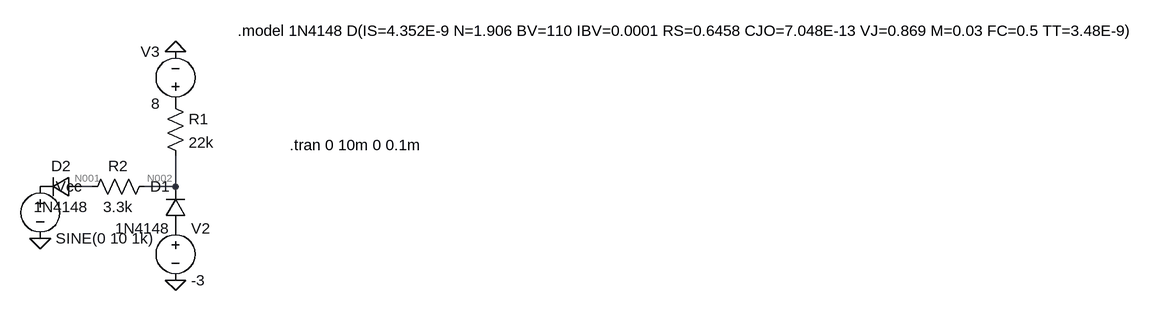
[diagram p0: schematic Draft1.asc]
Draft1.asc, the LTspice schematic file:
Version 4
SHEET 1 1808 680
WIRE 80 176 64 176
WIRE 208 176 208 128
WIRE 208 176 160 176
FLAG 0 256 0
FLAG 208 320 0
FLAG 208 -32 0
SYMBOL diode 224 240 R180
WINDOW 0 24 64 Left 2
WINDOW 3 24 0 Left 2
SYMATTR InstName D1
SYMATTR Value 1N4148
SYMBOL diode 64 160 R90
WINDOW 0 0 32 VBottom 2
WINDOW 3 32 32 VTop 2
SYMATTR InstName D2
SYMATTR Value 1N4148
SYMBOL res 192 32 R0
SYMATTR InstName R1
SYMATTR Value 22k
SYMBOL res 64 192 R270
WINDOW 0 32 56 VTop 2
WINDOW 3 0 56 VBottom 2
SYMATTR InstName R2
SYMATTR Value 3.3k
SYMBOL voltage 0 160 R0
WINDOW 123 0 0 Left 0
WINDOW 39 0 0 Left 0
SYMATTR InstName Vcc
SYMATTR Value SINE(0 10 1k)
SYMBOL voltage 208 224 R0
WINDOW 123 0 0 Left 0
WINDOW 39 0 0 Left 0
SYMATTR InstName V2
SYMATTR Value -3
SYMBOL voltage 208 64 R180
WINDOW 0 24 96 Left 2
WINDOW 3 24 16 Left 2
WINDOW 123 0 0 Left 0
WINDOW 39 0 0 Left 0
SYMATTR InstName V3
SYMATTR Value 8
TEXT 384 112 Left 2 !.tran 0 10m 0 0.1m
TEXT 304 -64 Left 2 !.model 1N4148 D(IS=4.352E-9 N=1.906 BV=110 IBV=0.0001 RS=0.6458 CJO=7.048E-13 VJ=0.869 M=0.03 FC=0.5 TT=3.48E-9)

The netlist it stands for:
* Draft1.asc
D1 P001 N002 1N4148
D2 N001 P002 1N4148
R1 P003 N002 22k
R2 N001 N002 3.3k
Vcc P002 0 SINE(0 10 1k)
V2 P001 0 -3
V3 P003 0 8
.model D D
.lib standard.dio
.tran 0 10m 0 0.1m
.model 1N4148 D(IS=4.352E-9 N=1.906 BV=110 IBV=0.0001 RS=0.6458 CJO=7.048E-13 VJ=0.869 M=0.03 FC=0.5 TT=3.48E-9)
.backanno
.end

* Results of the author's LTspice run, read from the files saved beside the schematic
* Operating Point, zero values left out:
*   V(p001) = -3 V
*   V(n002) = 1.52 V
*   V(n001) = 548.5 mV
*   V(p003) = 8 V
*   I(D2) = 294.5 µA
*   I(D1) = -4.357 nA
*   I(R2) = -294.5 µA
*   I(R1) = 294.5 µA
*   I(V3) = -294.5 µA
*   I(V2) = 4.357 nA
*   I(Vcc) = 294.5 µA
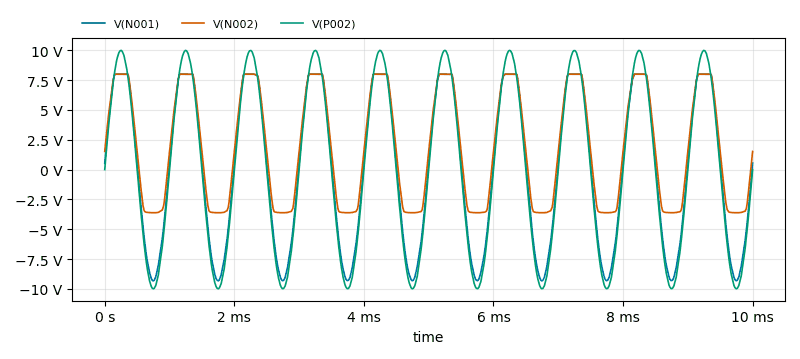
[diagram p1: Transient Analysis of Draft1.asc, plotted from the saved traces]
* Transient Analysis, 1 run:
*   V(N001): min -9.339 V, max 8.001 V, average 164.2 mV, rms 6.505 V, last 548.5 mV
*   V(N002): min -3.619 V, max 8.001 V, average 1.861 V, rms 5.168 V, last 1.52 V
*   V(P002): min -9.999 V, max 9.999 V, average -865.1 µV, rms 7.093 V, last 0 V